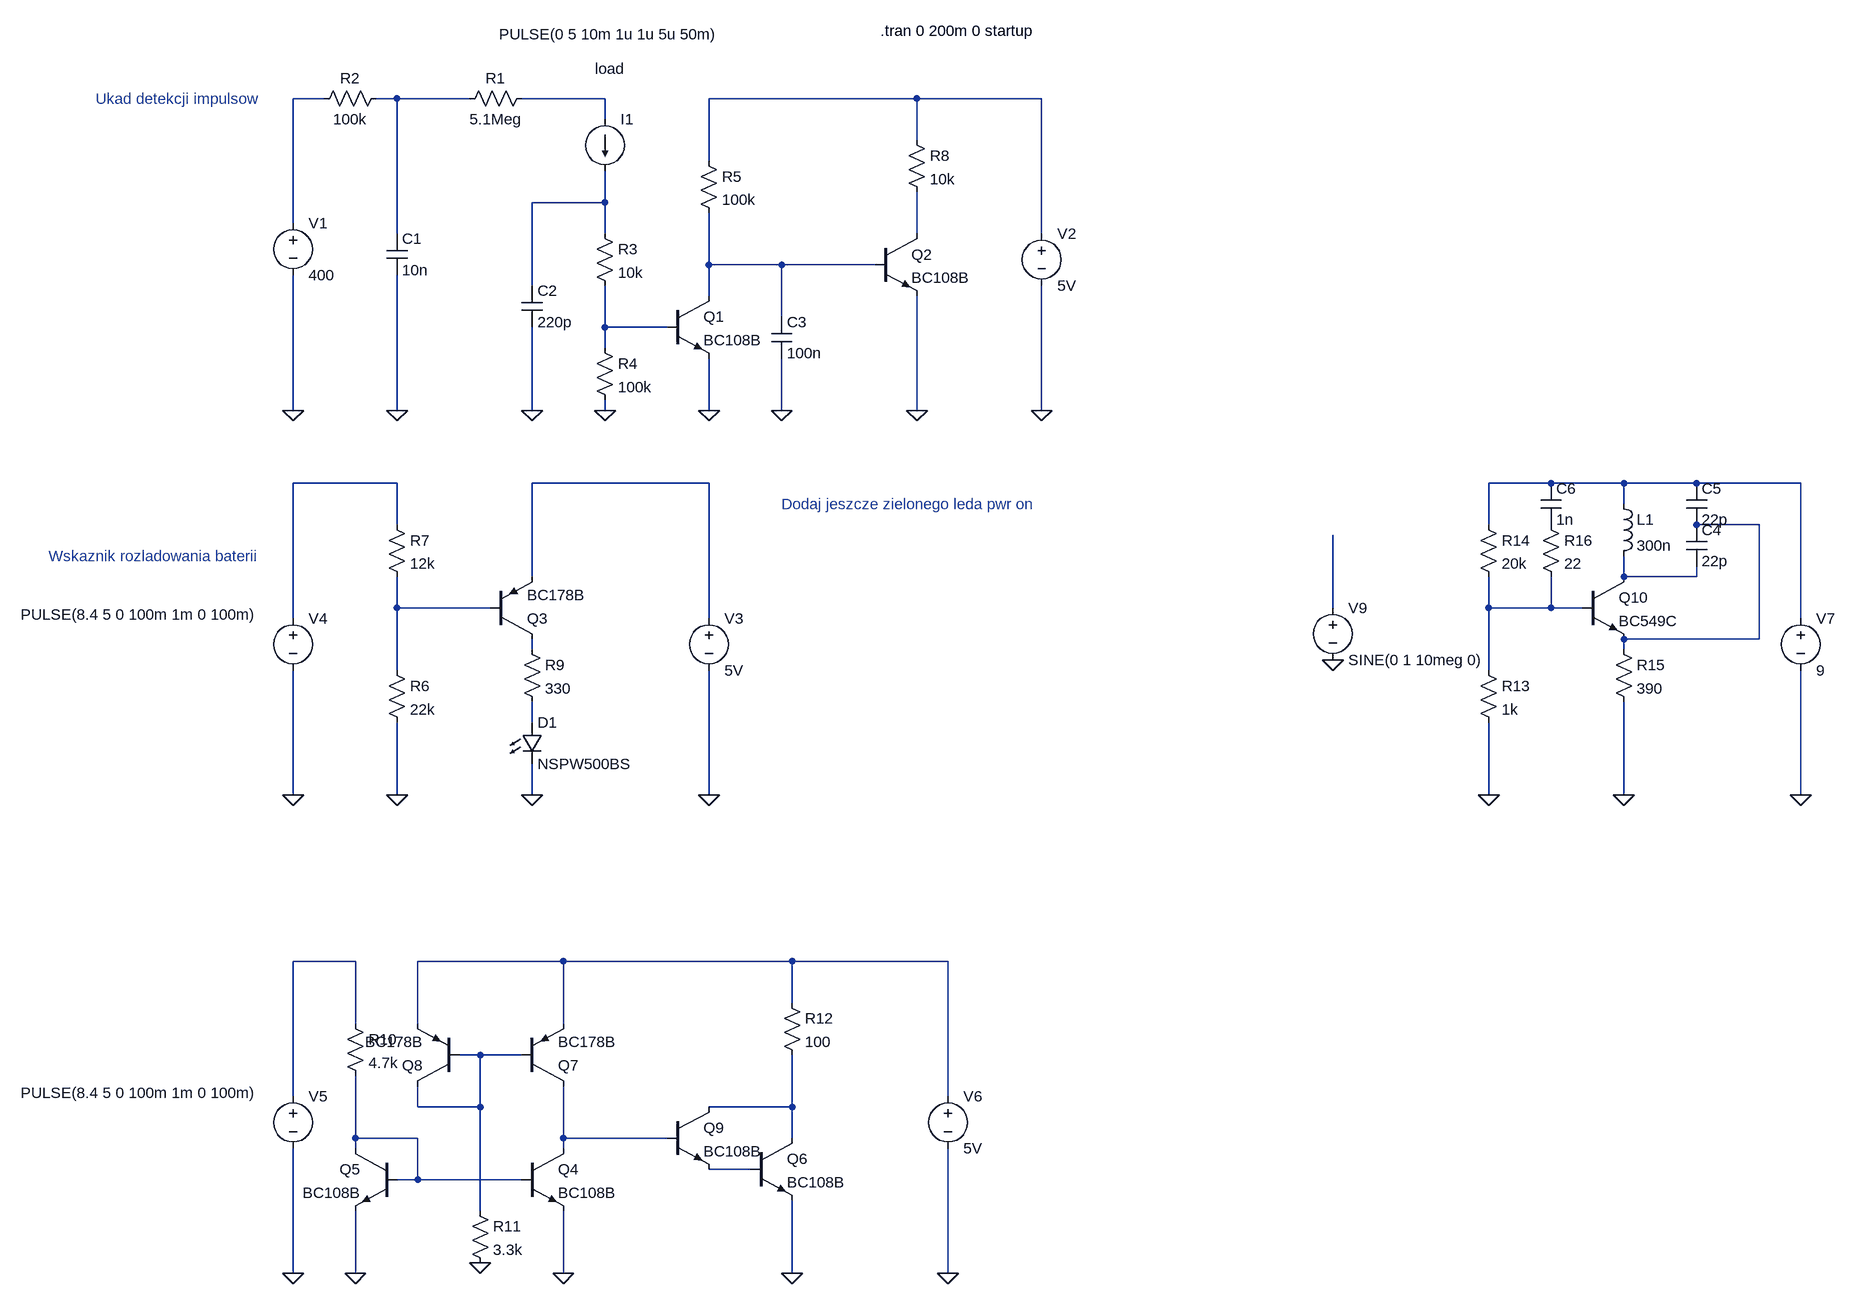
[diagram p0: schematic nadajnik.asc]
nadajnik.asc, the LTspice schematic file:
Version 4
SHEET 1 2296 1860
WIRE -32 32 -80 32
WIRE 80 32 48 32
WIRE 192 32 80 32
WIRE 400 32 272 32
WIRE 880 32 560 32
WIRE 1072 32 880 32
WIRE 400 64 400 32
WIRE 880 96 880 32
WIRE 560 128 560 32
WIRE 400 192 400 144
WIRE 400 192 288 192
WIRE -80 224 -80 32
WIRE 80 240 80 32
WIRE 400 240 400 192
WIRE 880 240 880 176
WIRE 1072 240 1072 32
WIRE 560 288 560 208
WIRE 672 288 560 288
WIRE 816 288 672 288
WIRE 288 320 288 192
WIRE 560 336 560 288
WIRE 672 368 672 288
WIRE 400 384 400 320
WIRE 496 384 400 384
WIRE 400 416 400 384
WIRE -80 512 -80 304
WIRE 80 512 80 304
WIRE 288 512 288 384
WIRE 400 512 400 496
WIRE 560 512 560 432
WIRE 672 512 672 432
WIRE 880 512 880 336
WIRE 1072 512 1072 320
WIRE 80 624 -80 624
WIRE 560 624 288 624
WIRE 1856 624 1760 624
WIRE 1968 624 1856 624
WIRE 2080 624 1968 624
WIRE 2240 624 2080 624
WIRE 1968 656 1968 624
WIRE 80 688 80 624
WIRE 1760 688 1760 624
WIRE 2176 688 2080 688
WIRE 288 768 288 624
WIRE 1968 768 1968 736
WIRE 2080 768 2080 752
WIRE 2080 768 1968 768
WIRE 80 816 80 768
WIRE 224 816 80 816
WIRE 1520 816 1520 704
WIRE 1760 816 1760 768
WIRE 1856 816 1856 768
WIRE 1856 816 1760 816
WIRE 1904 816 1856 816
WIRE -80 832 -80 624
WIRE 560 832 560 624
WIRE 2240 832 2240 624
WIRE 2176 864 2176 688
WIRE 2176 864 1968 864
WIRE 288 880 288 864
WIRE 1968 880 1968 864
WIRE 80 912 80 816
WIRE 1760 912 1760 816
WIRE 288 992 288 960
WIRE -80 1104 -80 912
WIRE 80 1104 80 992
WIRE 288 1104 288 1056
WIRE 560 1104 560 912
WIRE 1760 1104 1760 992
WIRE 1968 1104 1968 960
WIRE 2240 1104 2240 912
WIRE 16 1360 -80 1360
WIRE 336 1360 112 1360
WIRE 688 1360 336 1360
WIRE 928 1360 688 1360
WIRE 688 1424 688 1360
WIRE 16 1456 16 1360
WIRE 112 1456 112 1360
WIRE 336 1456 336 1360
WIRE 208 1504 176 1504
WIRE 272 1504 208 1504
WIRE -80 1568 -80 1360
WIRE 928 1568 928 1360
WIRE 112 1584 112 1552
WIRE 208 1584 208 1504
WIRE 208 1584 112 1584
WIRE 688 1584 688 1504
WIRE 688 1584 560 1584
WIRE 16 1632 16 1536
WIRE 112 1632 16 1632
WIRE 336 1632 336 1552
WIRE 496 1632 336 1632
WIRE 688 1632 688 1584
WIRE 16 1648 16 1632
WIRE 336 1648 336 1632
WIRE 624 1680 560 1680
WIRE 112 1696 112 1632
WIRE 112 1696 80 1696
WIRE 272 1696 112 1696
WIRE 208 1744 208 1584
WIRE -80 1840 -80 1648
WIRE 16 1840 16 1744
WIRE 336 1840 336 1744
WIRE 688 1840 688 1728
WIRE 928 1840 928 1648
FLAG -80 512 0
FLAG 400 512 0
FLAG 80 512 0
FLAG 288 512 0
FLAG 560 512 0
FLAG 672 512 0
FLAG 1072 512 0
FLAG 880 512 0
FLAG 560 1104 0
FLAG 288 1104 0
FLAG 80 1104 0
FLAG -80 1104 0
FLAG 16 1840 0
FLAG 336 1840 0
FLAG -80 1840 0
FLAG 928 1840 0
FLAG 688 1840 0
FLAG 208 1824 0
FLAG 2240 1104 0
FLAG 1968 1104 0
FLAG 1760 1104 0
FLAG 1520 896 0
SYMBOL voltage -80 208 R0
WINDOW 123 0 0 Left 0
WINDOW 39 0 0 Left 0
SYMATTR InstName V1
SYMATTR Value 400
SYMBOL res 288 16 R90
WINDOW 0 0 56 VBottom 2
WINDOW 3 32 56 VTop 2
SYMATTR InstName R1
SYMATTR Value 5.1Meg
SYMBOL current 400 64 R0
WINDOW 3 -163 -131 Left 2
WINDOW 123 0 0 Left 0
WINDOW 39 -15 -78 Left 2
SYMATTR Value PULSE(0 5 10m 1u 1u 5u 50m)
SYMATTR SpiceLine load
SYMATTR InstName I1
SYMBOL res 64 16 R90
WINDOW 0 0 56 VBottom 2
WINDOW 3 32 56 VTop 2
SYMATTR InstName R2
SYMATTR Value 100k
SYMBOL cap 64 240 R0
SYMATTR InstName C1
SYMATTR Value 10n
SYMBOL res 384 400 R0
SYMATTR InstName R4
SYMATTR Value 100k
SYMBOL cap 272 320 R0
SYMATTR InstName C2
SYMATTR Value 220p
SYMBOL npn 496 336 R0
SYMATTR InstName Q1
SYMATTR Value BC108B
SYMBOL res 544 112 R0
SYMATTR InstName R5
SYMATTR Value 100k
SYMBOL voltage 1072 224 R0
WINDOW 123 0 0 Left 0
WINDOW 39 0 0 Left 0
SYMATTR InstName V2
SYMATTR Value 5V
SYMBOL cap 656 368 R0
SYMATTR InstName C3
SYMATTR Value 100n
SYMBOL npn 816 240 R0
SYMATTR InstName Q2
SYMATTR Value BC108B
SYMBOL res 864 80 R0
SYMATTR InstName R8
SYMATTR Value 10k
SYMBOL res 384 224 R0
SYMATTR InstName R3
SYMATTR Value 10k
SYMBOL voltage 560 816 R0
WINDOW 123 0 0 Left 0
WINDOW 39 0 0 Left 0
SYMATTR InstName V3
SYMATTR Value 5V
SYMBOL pnp 224 864 M180
SYMATTR InstName Q3
SYMATTR Value BC178B
SYMBOL LED 272 992 R0
SYMATTR InstName D1
SYMATTR Value NSPW500BS
SYMBOL res 64 896 R0
SYMATTR InstName R6
SYMATTR Value 22k
SYMBOL voltage -80 816 R0
WINDOW 3 -419 10 Left 2
WINDOW 123 0 0 Left 0
WINDOW 39 0 0 Left 0
SYMATTR Value PULSE(8.4 5 0 100m 1m 0 100m)
SYMATTR InstName V4
SYMBOL res 64 672 R0
SYMATTR InstName R7
SYMATTR Value 12k
SYMBOL res 272 864 R0
SYMATTR InstName R9
SYMATTR Value 330
SYMBOL npn 272 1648 R0
SYMATTR InstName Q4
SYMATTR Value BC108B
SYMBOL npn 80 1648 M0
SYMATTR InstName Q5
SYMATTR Value BC108B
SYMBOL res 0 1440 R0
SYMATTR InstName R10
SYMATTR Value 4.7k
SYMBOL voltage -80 1552 R0
WINDOW 3 -419 10 Left 2
WINDOW 123 0 0 Left 0
WINDOW 39 0 0 Left 0
SYMATTR Value PULSE(8.4 5 0 100m 1m 0 100m)
SYMATTR InstName V5
SYMBOL voltage 928 1552 R0
WINDOW 123 0 0 Left 0
WINDOW 39 0 0 Left 0
SYMATTR InstName V6
SYMATTR Value 5V
SYMBOL res 672 1408 R0
SYMATTR InstName R12
SYMATTR Value 100
SYMBOL npn 624 1632 R0
SYMATTR InstName Q6
SYMATTR Value BC108B
SYMBOL pnp 272 1552 M180
SYMATTR InstName Q7
SYMATTR Value BC178B
SYMBOL pnp 176 1552 R180
SYMATTR InstName Q8
SYMATTR Value BC178B
SYMBOL res 192 1728 R0
SYMATTR InstName R11
SYMATTR Value 3.3k
SYMBOL npn 496 1584 R0
SYMATTR InstName Q9
SYMATTR Value BC108B
SYMBOL voltage 2240 816 R0
WINDOW 123 0 0 Left 0
WINDOW 39 0 0 Left 0
SYMATTR InstName V7
SYMATTR Value 9
SYMBOL res 1744 672 R0
SYMATTR InstName R14
SYMATTR Value 20k
SYMBOL res 1952 864 R0
SYMATTR InstName R15
SYMATTR Value 390
SYMBOL ind 1952 640 R0
SYMATTR InstName L1
SYMATTR Value 300n
SYMBOL cap 2064 688 R0
SYMATTR InstName C4
SYMATTR Value 22p
SYMBOL cap 2064 624 R0
SYMATTR InstName C5
SYMATTR Value 22p
SYMBOL npn 1904 768 R0
SYMATTR InstName Q10
SYMATTR Value BC549C
SYMBOL res 1744 896 R0
SYMATTR InstName R13
SYMATTR Value 1k
SYMBOL cap 1840 624 R0
SYMATTR InstName C6
SYMATTR Value 1n
SYMBOL voltage 1520 800 R0
WINDOW 123 0 0 Left 0
WINDOW 39 0 0 Left 0
SYMATTR InstName V9
SYMATTR Value SINE(0 1 10meg 0)
SYMBOL res 1840 672 R0
SYMATTR InstName R16
SYMATTR Value 22
TEXT 824 -72 Left 2 !.tran 0 200m 0 startup
TEXT -384 32 Left 2 ;Ukad detekcji impulsow
TEXT -456 736 Left 2 ;Wskaznik rozladowania baterii
TEXT 672 656 Left 2 ;Dodaj jeszcze zielonego leda pwr on

The netlist it stands for:
* nadajnik.asc
V1 N001 0 400
R1 N003 N002 5.1Meg
I1 N003 N005 PULSE(0 5 10m 1u 1u 5u 50m) load
R2 N002 N001 100k
C1 N002 0 10n
R4 N008 0 100k
C2 N005 0 220p
Q1 N007 N008 0 0 BC108B
R5 N004 N007 100k
V2 N004 0 5V
C3 N007 0 100n
Q2 N006 N007 0 0 BC108B
R8 N004 N006 10k
R3 N005 N008 10k
V3 N010 0 5V
Q3 N017 N014 N010 0 BC178B
D1 N018 0 NSPW500BS
R6 N014 0 22k
V4 N009 0 PULSE(8.4 5 0 100m 1m 0 100m)
R7 N009 N014 12k
R9 N017 N018 330
Q4 N024 N023 0 0 BC108B
Q5 N023 N023 0 0 BC108B
R10 N019 N023 4.7k
V5 N019 0 PULSE(8.4 5 0 100m 1m 0 100m)
V6 N020 0 5V
R12 N020 N022 100
Q6 N022 N025 0 0 BC108B
Q7 N024 N021 N020 0 BC178B
Q8 N021 N021 N020 0 BC178B
R11 N021 0 3.3k
Q9 N022 N024 N025 0 BC108B
V7 N011 0 9
R14 N011 N016 20k
R15 N012 0 390
L1 N011 N013 300n
C4 N012 N013 22p
C5 N011 N012 22p
Q10 N013 N016 N012 0 BC549C
R13 N016 0 1k
C6 N011 P001 1n
V9 N015 0 SINE(0 1 10meg 0)
R16 P001 N016 22
.model D D
.lib standard.dio
.model NPN NPN
.model PNP PNP
.lib standard.bjt
.tran 0 200m 0 startup
* Ukad detekcji impulsow
* Wskaznik rozladowania baterii
* Dodaj jeszcze zielonego leda pwr on
.backanno
.end